# Altium schematic sheet waku-ctl.SchDoc (part 3 of 5)
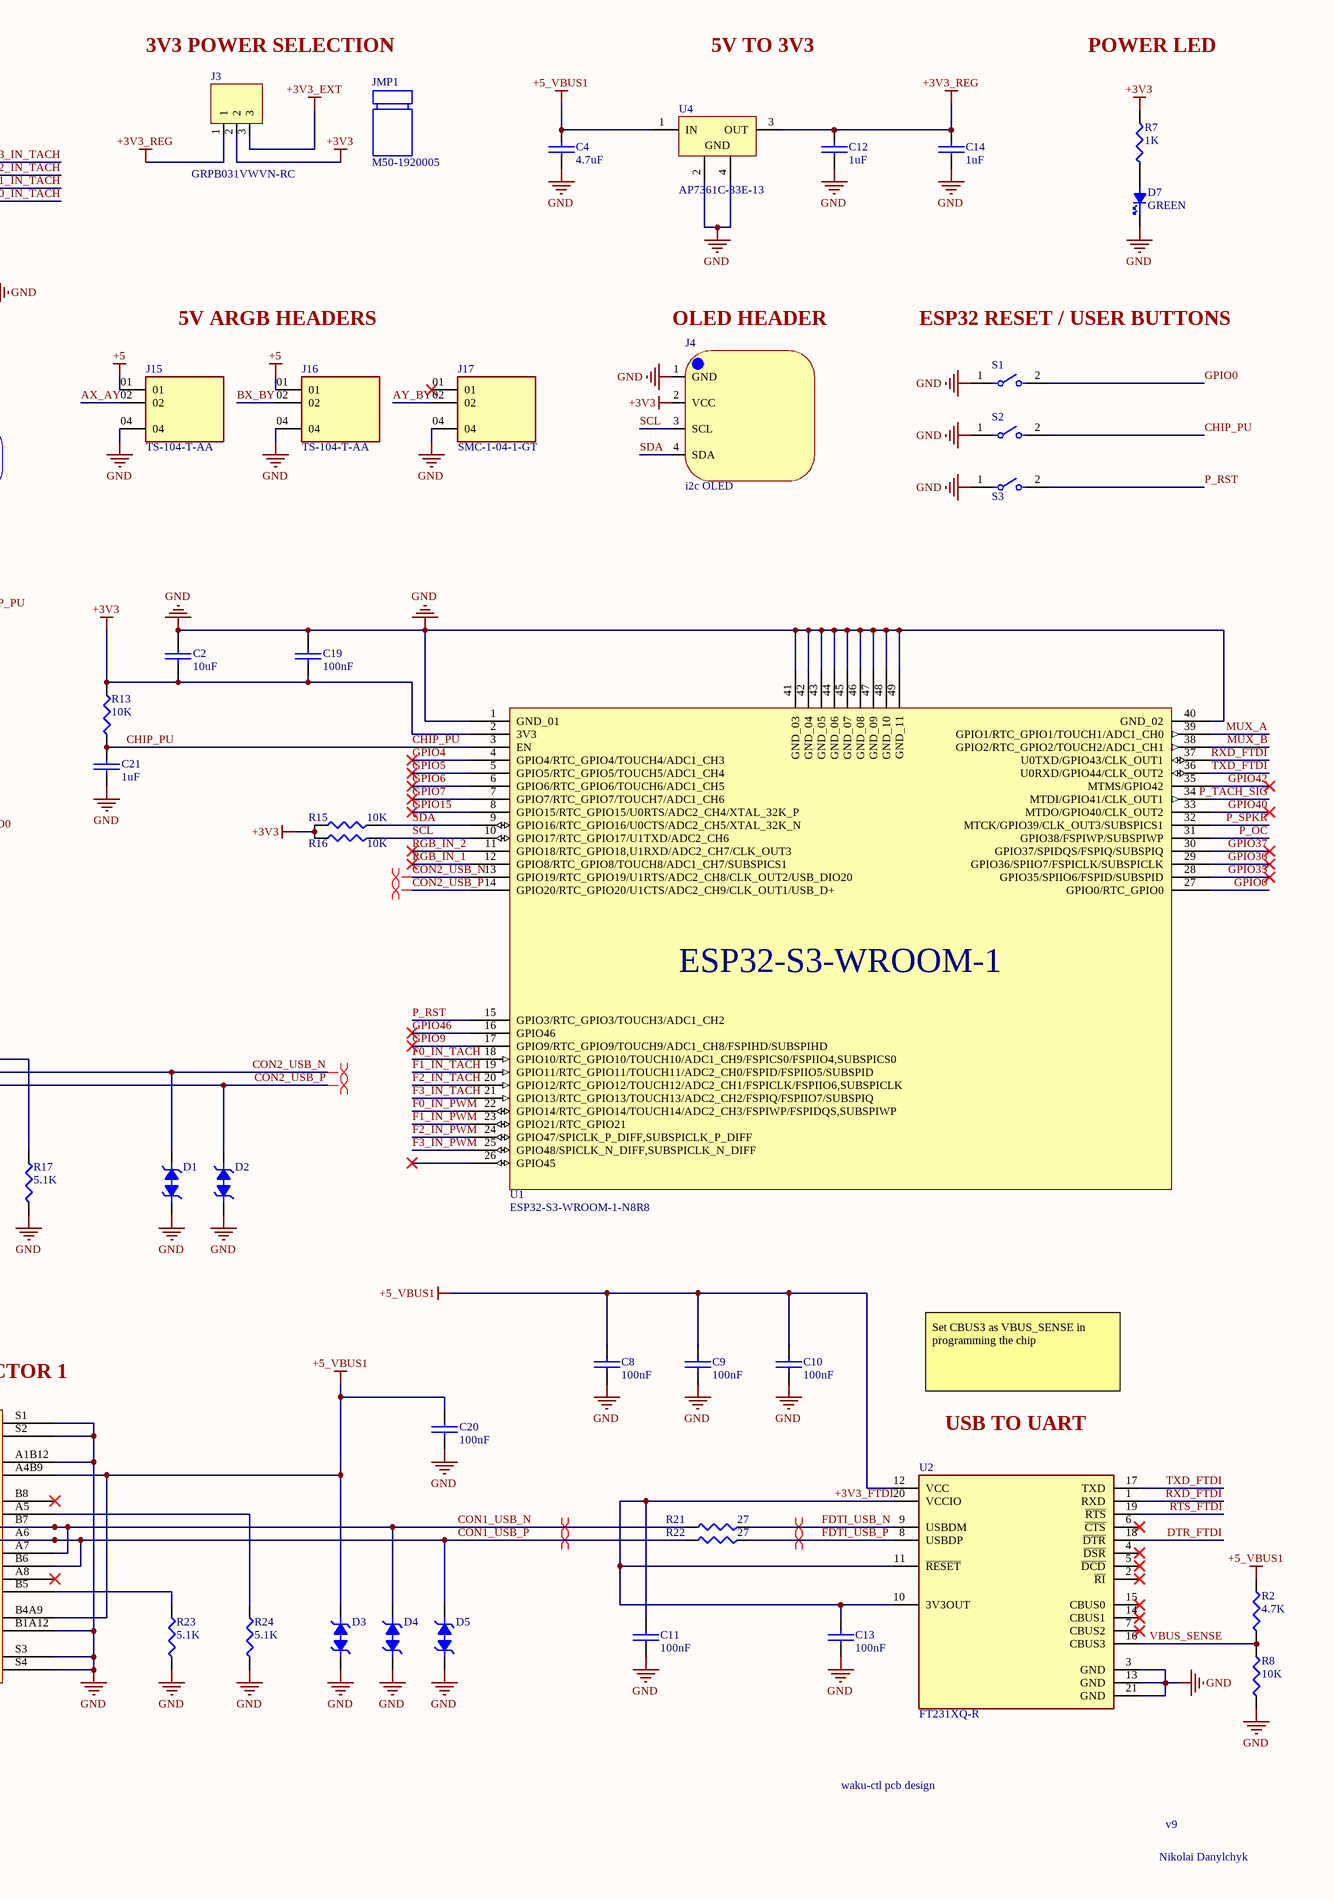
[diagram p3: waku-ctl.SchDoc, right]

## Library data of the parts (continued)
J13 = SSQ-102-02-T-S-RA: CONN RCPT 2POS 0.1 TIN PCB R/A; Manufacturer: Samtec; Manufacturer Lifecycle Status: PRODUCTION; Connector Type: Receptacle, Socket; Contact Resistance: 10mΩ; Current Rating: 6.3A; Lead Length: 2.54mm; Max Current Rating: 7.6A; Max Voltage Rating (AC): 550V; Number of Contacts: 2; Voltage Rating: 655V; Voltage Rating (AC): 465V; Supplier: DigiKey; Supplier Part Number: SAM1195-02-ND; Manufacturer Part Number: SSQ-102-02-T-S-RA; RoHS: Compliant; Category: Headers and Wire Housings; Stock: 1713; Pricing: 1=0.46, 10=0.39, 100=0.46, 500=0.29552, 1000=0.28141, 5000=0.25688 (EUR); Color: Black; Contact Material: Nickel, Tin; Contact Plating: Tin; Depth: 10.03mm; Height: 2.54mm; Housing Color: Black; Lead Free: Lead Free; Length: 5.59mm; Lifecycle Status: Production; Max Operating Temperature: 105°C; Min Operating Temperature: -55°C; Mounting Technology: Through Hole; Number of Positions: 2; Number of Rows: 1; Orientation: Right Angle; Packaging: Bulk; Pitch: 2.54mm; Radiation Hardening: No; Termination: Solder; Voltage Rating (DC): 655V; Width: 8.51mm; ComponentLink1URL: https://datasheet.octopart.com:443/SSQ-102-02-T-S-RA-Samtec-datasheet-150873487.pdf?src-supplier=Upverter; ComponentLink1Description: https://datasheet.octopart.com:443/SSQ-102-02-T-S-RA-Samtec-datasheet-150873487.pdf?src-supplier=Upverter; ComponentLink2URL: https://sigma.octopart.com:443/17020302/technical_drawing/Samtec-SSQ-102-02-T-S-RA.pdf?src-supplier=Upverter; ComponentLink2Description: https://sigma.octopart.com:443/17020302/technical_drawing/Samtec-SSQ-102-02-T-S-RA.pdf?src-supplier=Upverter; ComponentLink3URL: https://datasheet.octopart.com:443/SSQ-102-02-T-S-RA-Samtec-datasheet-97291133.pdf?src-supplier=element14+APAC; ComponentLink3Description: https://datasheet.octopart.com:443/SSQ-102-02-T-S-RA-Samtec-datasheet-97291133.pdf?src-supplier=element14+APAC; ComponentLink4URL: https://sigma.octopart.com:443/97291134/technical_drawing/Samtec-SSQ-102-02-T-S-RA.pdf?src-supplier=Samtec; ComponentLink4Description: https://sigma.octopart.com:443/97291134/technical_drawing/Samtec-SSQ-102-02-T-S-RA.pdf?src-supplier=Samtec; ComponentLink5URL: https://datasheet.octopart.com:443/SSQ-102-02-T-S-RA-Samtec-datasheet-118235309.pdf?src-supplier=Electro+Sonic; ComponentLink5Description: https://datasheet.octopart.com:443/SSQ-102-02-T-S-RA-Samtec-datasheet-118235309.pdf?src-supplier=Electro+Sonic; ComponentLink6URL: https://datasheet.octopart.com:443/SSQ-102-02-T-S-RA-Samtec-datasheet-86818373.pdf?src-supplier=Sager+Electronics; ComponentLink6Description: https://datasheet.octopart.com:443/SSQ-102-02-T-S-RA-Samtec-datasheet-86818373.pdf?src-supplier=Sager+Electronics; ComponentLink7URL: https://datasheet.octopart.com:443/SSQ-102-02-T-S-RA-Samtec-datasheet-133811811.pdf?src-supplier=JRH+Electronics; ComponentLink7Description: https://datasheet.octopart.com:443/SSQ-102-02-T-S-RA-Samtec-datasheet-133811811.pdf?src-supplier=JRH+Electronics; LCSC Part Number: C6824759
J15 J16 = TS-104-T-AA: NEEDLE CONN HEADER VERT 4POS 2.54MM; Manufacturer: Samtec; Manufacturer Lifecycle Status: PRODUCTION; Gender: Male; Max Current Rating: 1A; Number of Contacts: 4; Supplier: DigiKey; Supplier Part Number: SAM16040-ND; Manufacturer Part Number: TS-104-T-AA; RoHS: Compliant; Category: Headers and Wire Housings; Stock: 919; Pricing: 1=0.62, 50=0.4858, 100=0.62, 500=0.3324, 1000=0.31706 (EUR); Contact Material: Brass; Contact Plating: Tin; Lifecycle Status: Production; Max Operating Temperature: 105°C; Min Operating Temperature: -55°C; Mounting Technology: Through Hole; Number of Rows: 1; Orientation: Straight; Pitch: 2.54mm; Radiation Hardening: No; REACH SVHC: No; Termination: Solder; ComponentLink1URL: https://datasheet.octopart.com:443/TS-104-T-AA-Samtec-datasheet-97318998.pdf?src-supplier=Master+Electronics; ComponentLink1Description: https://datasheet.octopart.com:443/TS-104-T-AA-Samtec-datasheet-97318998.pdf?src-supplier=Master+Electronics; ComponentLink2URL: https://datasheet.octopart.com:443/TS-104-T-AA-Samtec-datasheet-150856305.pdf?src-supplier=Electro+Sonic; ComponentLink2Description: https://datasheet.octopart.com:443/TS-104-T-AA-Samtec-datasheet-150856305.pdf?src-supplier=Electro+Sonic; ComponentLink3URL: https://datasheet.octopart.com:443/TS-104-T-AA-Samtec-datasheet-13698575.pdf?src-supplier=Electro+Sonic; ComponentLink3Description: https://datasheet.octopart.com:443/TS-104-T-AA-Samtec-datasheet-13698575.pdf?src-supplier=Electro+Sonic; ComponentLink4URL: https://datasheet.octopart.com:443/TS-104-T-AA-Samtec-datasheet-37173861.pdf?src-supplier=Electro+Sonic; ComponentLink4Description: https://datasheet.octopart.com:443/TS-104-T-AA-Samtec-datasheet-37173861.pdf?src-supplier=Electro+Sonic; ComponentLink5URL: https://datasheet.octopart.com:443/TS-104-T-AA-Samtec-datasheet-41643166.pdf?src-supplier=Farnell; ComponentLink5Description: https://datasheet.octopart.com:443/TS-104-T-AA-Samtec-datasheet-41643166.pdf?src-supplier=Farnell; ComponentLink6URL: https://datasheet.octopart.com:443/TS-104-T-AA-Samtec-datasheet-28904454.pdf?src-supplier=Farnell; ComponentLink6Description: https://datasheet.octopart.com:443/TS-104-T-AA-Samtec-datasheet-28904454.pdf?src-supplier=Farnell; ComponentLink7URL: https://datasheet.octopart.com:443/TS-104-T-AA-Samtec-datasheet-8451641.pdf?src-supplier=Farnell; ComponentLink7Description: https://datasheet.octopart.com:443/TS-104-T-AA-Samtec-datasheet-8451641.pdf?src-supplier=Farnell; ComponentLink8URL: https://datasheet.octopart.com:443/TS-104-T-AA-Samtec-datasheet-179090728.pdf?src-supplier=Sager+Electronics; ComponentLink8Description: https://datasheet.octopart.com:443/TS-104-T-AA-Samtec-datasheet-179090728.pdf?src-supplier=Sager+Electronics; ComponentLink9URL: https://datasheet.octopart.com:443/TS-104-T-AA-Samtec-datasheet-118235246.pdf?src-supplier=Sager+Electronics; ComponentLink9Description: https://datasheet.octopart.com:443/TS-104-T-AA-Samtec-datasheet-118235246.pdf?src-supplier=Sager+Electronics; ComponentLink10URL: https://datasheet.octopart.com:443/TS-104-T-AA-Samtec-datasheet-116533476.pdf?src-supplier=Toby+Electronics; ComponentLink10Description: https://datasheet.octopart.com:443/TS-104-T-AA-Samtec-datasheet-116533476.pdf?src-supplier=Toby+Electronics; ComponentLink11URL: https://datasheet.octopart.com:443/TS-104-T-AA-Samtec-datasheet-116536303.pdf?src-supplier=Toby+Electronics; ComponentLink11Description: https://datasheet.octopart.com:443/TS-104-T-AA-Samtec-datasheet-116536303.pdf?src-supplier=Toby+Electronics; LCSC Part Number: C6886151
J17 = SMC-1-04-1-GT: MACHINE PIN SOCKET 4P 2.54MM PIT; Manufacturer: Adam Tech; Current Rating: 3A; Insulation Resistance: 10GΩ; Supplier: DigiKey; Supplier Part Number: 2057-SMC-1-04-1-GT-ND; Manufacturer Part Number: SMC-1-04-1-GT; RoHS: Compliant; Category: Headers and Wire Housings; Pricing: 1=0.22, 10=0.193, 25=0.22, 50=0.1728, 100=0.1644, 250=0.15408, 500=0.14672, 1000=0.13971, 3000=0.12928 (EUR); Lifecycle Status: Production; Max Operating Temperature: 125°C; Min Operating Temperature: -55°C; Pins: 4; REACH SVHC: Yes; Schedule B: 8536694040, 8536694040|8536694040|8536694040|8536694040|8536694040; Terminal Pitch: 2.54mm; ComponentLink1URL: https://datasheet.octopart.com:443/SMC-1-04-1-GT-Adam-Tech-datasheet-175106907.pdf?src-supplier=IHS; ComponentLink1Description: https://datasheet.octopart.com:443/SMC-1-04-1-GT-Adam-Tech-datasheet-175106907.pdf?src-supplier=IHS; ComponentLink2URL: https://datasheet.octopart.com:443/SMC-1-04-1-GT-Adam-Tech-datasheet-110600998.pdf?src-supplier=RS+(Formerly+Allied+Electronics); ComponentLink2Description: https://datasheet.octopart.com:443/SMC-1-04-1-GT-Adam-Tech-datasheet-110600998.pdf?src-supplier=RS+(Formerly+Allied+Electronics); ComponentLink3URL: http://sigma.octopart.com:80/rohs_statement/Adam-Tech-company-22.pdf?src-supplier=Compliance+Statements; ComponentLink3Description: http://sigma.octopart.com:80/rohs_statement/Adam-Tech-company-22.pdf?src-supplier=Compliance+Statements; ComponentLink4URL: http://sigma.octopart.com:80/reach_statement/Adam-Tech-company-23.pdf?src-supplier=Compliance+Statements; ComponentLink4Description: http://sigma.octopart.com:80/reach_statement/Adam-Tech-company-23.pdf?src-supplier=Compliance+Statements
JMP1 = M50-1920005: CONN SHUNT 1.27MM; Manufacturer: Harwin; Contact Resistance: 20mΩ; Current Rating: 1A; Insulation Resistance: 1GΩ; Number of Positions: 2; Voltage Rating: 500V; Supplier: DigiKey; Supplier Part Number: 952-1727-ND; Manufacturer Part Number: M50-1920005; RoHS: Compliant; Category: Headers and Wire Housings; Stock: 2688; Pricing: 1=0.33, 10=0.284, 25=0.2664, 50=0.2536, 100=0.2414, 250=0.22628, 500=0.21546, 1000=0.20516, 3000=0.18984 (USD); Color: Red; Contact Gender: Female; Contact Plating: Gold; Flammability Rating: UL94 V-0; Height: 2.9972mm; Housing Material: Nylon; Lifecycle Status: Production; Max Operating Temperature: 105°C; Min Operating Temperature: -40°C; Pins: 2; Pitch: 1.27mm; REACH SVHC: Yes; ComponentLink1URL: https://datasheet.octopart.com:443/M50-1920005-Harwin-datasheet-179992058.pdf?src-supplier=IHS; ComponentLink1Description: https://datasheet.octopart.com:443/M50-1920005-Harwin-datasheet-179992058.pdf?src-supplier=IHS; ComponentLink2URL: https://datasheet.octopart.com:443/M50-1920005-Harwin-datasheet-27707384.pdf?src-supplier=Newark; ComponentLink2Description: https://datasheet.octopart.com:443/M50-1920005-Harwin-datasheet-27707384.pdf?src-supplier=Newark; ComponentLink3URL: https://datasheet.octopart.com:443/M50-1920005-Harwin-datasheet-10841850.pdf?src-supplier=element14+APAC; ComponentLink3Description: https://datasheet.octopart.com:443/M50-1920005-Harwin-datasheet-10841850.pdf?src-supplier=element14+APAC; LCSC Part Number: C2758458
OP1 = PS2701A-1-F3-A: OPTOISO 3.75KV 1CH TRANS 4-SOP; Manufacturer: Renesas; Manufacturer Lifecycle Status: ACTIVE; Collector Emitter Breakdown Voltage: 70V; Collector Emitter Saturation Voltage: 300mV; Current Transfer Ratio: 50%; Dark Current: 100nA; Fall Time: 7µs; Forward Current: 50mA; Forward Voltage: 1.4V; Input Current: 5mA; Max Collector Current: 30mA; Max Power Dissipation: 230mW; Number of Channels: 1; Output Voltage: 40V; RAM Size: 16kB; Reverse Breakdown Voltage: 6V; Rise Time: 5µs; Supplier: DigiKey; Supplier Part Number: 559-1154-1-ND; Manufacturer Part Number: PS2701A-1-F3-A; RoHS: Compliant; Category: Optocouplers; Stock: 13270; Pricing: 1=0.84, 10=0.591, 100=0.84, 500=0.36802, 1000=0.34545 (EUR); Case/Package: SOP; China RoHS: Compliant; Collector Emitter Voltage (VCEO): 70V; Contact Plating: Tin Bismuth; Export Control Classification Number (ECCN) Code: EAR99; Part Family: PS2701A-1; Height: 2.3mm; Harmonized Tariff Schedule (HTS) Code: 8541.49.8000; Isolation Voltage: 3.75kV; Lead Free: Lead Free; Lifecycle Status: Production; Max Input Current: 30mA; Max Operating Temperature: 100°C; Max Output Voltage: 70V; Min Operating Temperature: -55°C; MSL: 1; Mounting Technology: Surface Mount; Number of Circuits: 1; Number of Elements: 1; Pins: 4; Power Dissipation: 230mW; Radiation Hardening: No; REACH SVHC: Yes; Reverse Voltage: 6V; ComponentLink1URL: https://datasheet.octopart.com:443/PS2701A-1-F3-A-Renesas-datasheet-157819089.pdf?src-supplier=Newark; ComponentLink1Description: https://datasheet.octopart.com:443/PS2701A-1-F3-A-Renesas-datasheet-157819089.pdf?src-supplier=Newark; ComponentLink2URL: https://datasheet.octopart.com:443/PS2701A-1-F3-A-Renesas-datasheet-179182223.pdf?src-supplier=Integrated+Device+Technology; ComponentLink2Description: https://datasheet.octopart.com:443/PS2701A-1-F3-A-Renesas-datasheet-179182223.pdf?src-supplier=Integrated+Device+Technology; ComponentLink3URL: https://datasheet.octopart.com:443/PS2701A-1-F3-A-Renesas-datasheet-149188193.pdf?src-supplier=Integrated+Device+Technology; ComponentLink3Description: https://datasheet.octopart.com:443/PS2701A-1-F3-A-Renesas-datasheet-149188193.pdf?src-supplier=Integrated+Device+Technology; ComponentLink4URL: https://datasheet.octopart.com:443/PS2701A-1-F3-A-NEC-datasheet-180895236.pdf?src-supplier=IHS; ComponentLink4Description: https://datasheet.octopart.com:443/PS2701A-1-F3-A-NEC-datasheet-180895236.pdf?src-supplier=IHS; ComponentLink5URL: https://datasheet.octopart.com:443/PS2701A-1-F3-A-Renesas-datasheet-141895261.pdf?src-supplier=Renesas; ComponentLink5Description: https://datasheet.octopart.com:443/PS2701A-1-F3-A-Renesas-datasheet-141895261.pdf?src-supplier=Renesas; ComponentLink6URL: https://datasheet.octopart.com:443/PS2701A-1-F3-A-Renesas-datasheet-138175344.pdf?src-supplier=Renesas; ComponentLink6Description: https://datasheet.octopart.com:443/PS2701A-1-F3-A-Renesas-datasheet-138175344.pdf?src-supplier=Renesas; ComponentLink7URL: https://datasheet.octopart.com:443/PS2701A-1-F3-A-Renesas-datasheet-5436770.pdf?src-supplier=element14+APAC; ComponentLink7Description: https://datasheet.octopart.com:443/PS2701A-1-F3-A-Renesas-datasheet-5436770.pdf?src-supplier=element14+APAC; ComponentLink8URL: https://datasheet.octopart.com:443/PS2701A-1-F3-A-Renesas-datasheet-164380605.pdf?src-supplier=SOS+electronic; ComponentLink8Description: https://datasheet.octopart.com:443/PS2701A-1-F3-A-Renesas-datasheet-164380605.pdf?src-supplier=SOS+electronic; ComponentLink9URL: https://datasheet.octopart.com:443/PS2701A-1-F3-A-Renesas-datasheet-134697512.pdf?src-supplier=TME; ComponentLink9Description: https://datasheet.octopart.com:443/PS2701A-1-F3-A-Renesas-datasheet-134697512.pdf?src-supplier=TME; ComponentLink10URL: https://datasheet.octopart.com:443/PS2701A-1-F3-A-Renesas-datasheet-136482170.pdf?src-supplier=Future+Electronics; ComponentLink10Description: https://datasheet.octopart.com:443/PS2701A-1-F3-A-Renesas-datasheet-136482170.pdf?src-supplier=Future+Electronics; ComponentLink11URL: http://sigma.octopart.com:80/conflict_mineral_statement/Renesas-company-44.pdf?src-supplier=Compliance+Statements; ComponentLink11Description: http://sigma.octopart.com:80/conflict_mineral_statement/Renesas-company-44.pdf?src-supplier=Compliance+Statements; ComponentLink12URL: http://sigma.octopart.com:80/reach_statement/Renesas-company-45.pdf?src-supplier=Compliance+Statements; ComponentLink12Description: http://sigma.octopart.com:80/reach_statement/Renesas-company-45.pdf?src-supplier=Compliance+Statements; LCSC Part Number: C5334508
Q1-Q3 = SS8050-G: TRANS NPN 25V 1.5A SOT-23-3; Manufacturer: Comchip; Collector Base Voltage (VCBO): 40V; Collector Emitter Saturation Voltage: 500mV; Emitter Base Voltage (VEBO): 5V; hFE Min: 40; Max Junction Temperature (Tj): 150°C; Max Power Dissipation: 300mW; Number of Elements: 1; Transition Frequency: 100MHz; Supplier: DigiKey; Supplier Part Number: 641-1790-1-ND; Manufacturer Part Number: SS8050-G; RoHS: Compliant; Category: BJTs; Stock: 59487; Pricing: 1=0.2, 10=0.126, 100=0.2, 500=0.05756, 1000=0.05078 (EUR); Case/Package: TO-236-3; Collector Emitter Breakdown Voltage: 25V; Collector Emitter Voltage (VCEO): 25V; Height: 1.15mm; Lifecycle Status: Production; Max Breakdown Voltage: 25V; Max Collector Current: 1.5A; Max Operating Temperature: 150°C; Mounting Technology: Surface Mount; Number of Terminals: 3; Power Dissipation: 300mW; REACH SVHC: Yes; Schedule B: 8541100070|8541100070|8541100070|8541100070|8541100070; ComponentLink1URL: https://datasheet.octopart.com:443/SS8050-G-Comchip-datasheet-180131983.pdf?src-supplier=IHS; ComponentLink1Description: https://datasheet.octopart.com:443/SS8050-G-Comchip-datasheet-180131983.pdf?src-supplier=IHS; ComponentLink2URL: https://datasheet.octopart.com:443/SS8050-G-Comchip-datasheet-155422643.pdf?src-supplier=Upverter; ComponentLink2Description: https://datasheet.octopart.com:443/SS8050-G-Comchip-datasheet-155422643.pdf?src-supplier=Upverter; ComponentLink3URL: https://datasheet.octopart.com:443/SS8050-G-Comchip-datasheet-189767092.pdf?src-supplier=ODG+(Origin+Data+Global); ComponentLink3Description: https://datasheet.octopart.com:443/SS8050-G-Comchip-datasheet-189767092.pdf?src-supplier=ODG+(Origin+Data+Global); LCSC Part Number: C164886
R1 = RC0603FR-07330RL: RES 330 OHM 1% 1/10W 0603; Manufacturer: Yageo Group; Value: 47µF; ESR (Equivalent Series Resistance): 800mΩ; Max Power Dissipation: 100mW; Temperature Coefficient: 100ppm/°C; Voltage Rating: 16V; Voltage Rating (AC): 50V; Working Voltage: 75V; Supplier: DigiKey; Supplier Part Number: 311-330HRCT-ND; Manufacturer Part Number: RC0603FR-07330RL; RoHS: Compliant; Category: Chip SMD Resistors; Stock: 52985; Pricing: 1=0.1, 10=0.022, 25=0.0164, 50=0.013, 100=0.0106, 250=0.00812, 500=0.00676, 1000=0.00569 (USD); Case/Package: 2917; Case Code (Imperial): 2917; Case Code (Metric): 7343; China RoHS: Non-Compliant; Composition: Thick Film; Depth: 800µm; Features: Moisture Resistant; Height: 450µm; Lead Free: Lead Free; Length: 7.3mm; Lifecycle Status: Production; Max Operating Temperature: 155°C; Min Operating Temperature: -55°C; Mounting Technology: Surface Mount; Pins: 2; Number of Terminals: 2; Number of Terminations: 2; Packaging: Tape and Reel; Power Dissipation: 100mW; Power Rating: 100mW; Radiation Hardening: No; REACH SVHC: Yes; Schedule B: 8533210045, 8533210045|8533210045, 8533210045|8533210045|8533210045, 8533210045|8533210045|8533210045|8533210045; Termination: SMD/SMT; Tolerance: 1%; Voltage Rating (DC): 16V; Width: 800µm; ComponentLink1URL: https://datasheet.octopart.com:443/RC0603FR-07330RL-Yageo-datasheet-175887523.pdf?src-supplier=IHS; ComponentLink1Description: https://datasheet.octopart.com:443/RC0603FR-07330RL-Yageo-datasheet-175887523.pdf?src-supplier=IHS; ComponentLink2URL: https://datasheet.octopart.com:443/RC0603FR-07330RL-Yageo-datasheet-62067350.pdf?src-supplier=Newark; ComponentLink2Description: https://datasheet.octopart.com:443/RC0603FR-07330RL-Yageo-datasheet-62067350.pdf?src-supplier=Newark; ComponentLink3URL: https://datasheet.octopart.com:443/RC0603FR-07330RL-Yageo-datasheet-12596169.pdf?src-supplier=Newark; ComponentLink3Description: https://datasheet.octopart.com:443/RC0603FR-07330RL-Yageo-datasheet-12596169.pdf?src-supplier=Newark; ComponentLink4URL: https://datasheet.octopart.com:443/RC0603FR-07330RL-Yageo-datasheet-503470.pdf?src-supplier=Newark; ComponentLink4Description: https://datasheet.octopart.com:443/RC0603FR-07330RL-Yageo-datasheet-503470.pdf?src-supplier=Newark; ComponentLink5URL: https://datasheet.octopart.com:443/RC0603FR-07330RL-Yageo-datasheet-34211833.pdf?src-supplier=Newark; ComponentLink5Description: https://datasheet.octopart.com:443/RC0603FR-07330RL-Yageo-datasheet-34211833.pdf?src-supplier=Newark; ComponentLink6URL: https://datasheet.octopart.com:443/RC0603FR-07330RL-Yageo-datasheet-103092701.pdf?src-supplier=Upverter; ComponentLink6Description: https://datasheet.octopart.com:443/RC0603FR-07330RL-Yageo-datasheet-103092701.pdf?src-supplier=Upverter; ComponentLink7URL: https://datasheet.octopart.com:443/RC0603FR-07330RL-Yageo-datasheet-98239111.pdf?src-supplier=Upverter; ComponentLink7Description: https://datasheet.octopart.com:443/RC0603FR-07330RL-Yageo-datasheet-98239111.pdf?src-supplier=Upverter; ComponentLink8URL: https://datasheet.octopart.com:443/RC0603FR-07330RL-Yageo-datasheet-8328172.pdf?src-supplier=element14+APAC; ComponentLink8Description: https://datasheet.octopart.com:443/RC0603FR-07330RL-Yageo-datasheet-8328172.pdf?src-supplier=element14+APAC; ComponentLink9URL: https://datasheet.octopart.com:443/RC0603FR-07330RL-Yageo-datasheet-15599030.pdf?src-supplier=Future+Electronics; ComponentLink9Description: https://datasheet.octopart.com:443/RC0603FR-07330RL-Yageo-datasheet-15599030.pdf?src-supplier=Future+Electronics; ComponentLink10URL: https://datasheet.octopart.com:443/RC0603FR-07330RL-Yageo-datasheet-164759695.pdf?src-supplier=Future+Electronics; ComponentLink10Description: https://datasheet.octopart.com:443/RC0603FR-07330RL-Yageo-datasheet-164759695.pdf?src-supplier=Future+Electronics; ComponentLink11URL: https://datasheet.octopart.com:443/RC0603FR-07330RL-Yageo-datasheet-137700087.pdf?src-supplier=Future+Electronics; ComponentLink11Description: https://datasheet.octopart.com:443/RC0603FR-07330RL-Yageo-datasheet-137700087.pdf?src-supplier=Future+Electronics; ComponentLink12URL: https://datasheet.octopart.com:443/RC0603FR-07330RL-Yageo-datasheet-27584510.pdf?src-supplier=Future+Electronics; ComponentLink12Description: https://datasheet.octopart.com:443/RC0603FR-07330RL-Yageo-datasheet-27584510.pdf?src-supplier=Future+Electronics; ComponentLink13URL: https://datasheet.octopart.com:443/RC0603FR-07330RL-Yageo-datasheet-8324193.pdf?src-supplier=Future+Electronics; ComponentLink13Description: https://datasheet.octopart.com:443/RC0603FR-07330RL-Yageo-datasheet-8324193.pdf?src-supplier=Future+Electronics; ComponentLink14URL: https://datasheet.octopart.com:443/RC0603FR-07330RL-Yageo-datasheet-79472498.pdf?src-supplier=Megastar; ComponentLink14Description: https://datasheet.octopart.com:443/RC0603FR-07330RL-Yageo-datasheet-79472498.pdf?src-supplier=Megastar; ComponentLink15URL: https://datasheet.octopart.com/RC0603FR-07330RL-Yageo-datasheet-73766026.pdf; ComponentLink15Description: https://datasheet.octopart.com/RC0603FR-07330RL-Yageo-datasheet-73766026.pdf; ComponentLink16URL: https://datasheet.octopart.com:443/RC0603FR-07330RL-Yageo-datasheet-13691069.pdf?src-supplier=Farnell; ComponentLink16Description: https://datasheet.octopart.com:443/RC0603FR-07330RL-Yageo-datasheet-13691069.pdf?src-supplier=Farnell; ComponentLink17URL: https://datasheet.octopart.com:443/RC0603FR-07330RL-Yageo-datasheet-118562.pdf?src-supplier=DigiKey; ComponentLink17Description: https://datasheet.octopart.com:443/RC0603FR-07330RL-Yageo-datasheet-118562.pdf?src-supplier=DigiKey; ComponentLink18URL: http://sigma.octopart.com:80/rohs_statement/Yageo-company-2.pdf?src-supplier=Compliance+Statements; ComponentLink18Description: http://sigma.octopart.com:80/rohs_statement/Yageo-company-2.pdf?src-supplier=Compliance+Statements; ComponentLink19URL: http://sigma.octopart.com:80/conflict_mineral_statement/Yageo-company-3.pdf?src-supplier=Compliance+Statements; ComponentLink19Description: http://sigma.octopart.com:80/conflict_mineral_statement/Yageo-company-3.pdf?src-supplier=Compliance+Statements; LCSC Part Number: C105881
R2 = RC0603FR-074K7L: RES 4.7K OHM 1% 1/10W 0603; Manufacturer: Yageo Group; Power Dissipation: 100mW; Value: 4.7kΩ; Temperature Coefficient: 100ppm/°C; Voltage Rating: 75V; Voltage Rating (DC): 50V; Supplier: DigiKey; Supplier Part Number: 311-4.70KHRDKR-ND; Manufacturer Part Number: RC0603FR-074K7L; RoHS: Compliant; Category: Chip SMD Resistors; Stock: 232694; Pricing: 1=0.1, 10=0.009, 25=0.0088, 50=0.0052 (USD); Case/Package: 0603; Case Code (Imperial): 0603; China RoHS: Non-Compliant; Composition: Thick Film; Depth: 800µm; Height: 450µm; Lead Free: Lead Free; Lead Pitch: 300µm; Length: 1.6mm; Lifecycle Status: Production; Max Operating Temperature: 155°C; Military Standard: Not; Min Operating Temperature: -55°C; Mounting Technology: Surface Mount; Pins: 2; Number of Terminals: 2; Packaging: Tape & Reel; Power Rating: 100mW; REACH SVHC: Yes; Schedule B: 8533210045, 8533210045|8533210045|8533210045|8533210045|8533210045|8533210045|8533210045|8533210045|8533210045|8533210045|8533210045|8533210045|8533210045|8533210045|8533210045|8533210045|8533210045|8533210045|8533210045|8533210045|8533210045|8533210045|8533210045|85; Termination: SMD/SMT; Tolerance: 1%; Width: 800µm; Working Voltage: 75V; ComponentLink1URL: https://datasheet.octopart.com:443/RC0603FR-074K7L-Yageo-datasheet-175887523.pdf?src-supplier=IHS; ComponentLink1Description: https://datasheet.octopart.com:443/RC0603FR-074K7L-Yageo-datasheet-175887523.pdf?src-supplier=IHS; ComponentLink2URL: https://datasheet.octopart.com:443/RC0603FR-074K7L-Yageo-datasheet-103092701.pdf?src-supplier=Upverter; ComponentLink2Description: https://datasheet.octopart.com:443/RC0603FR-074K7L-Yageo-datasheet-103092701.pdf?src-supplier=Upverter; ComponentLink3URL: https://datasheet.octopart.com:443/RC0603FR-074K7L-Yageo-datasheet-8328172.pdf?src-supplier=Farnell; ComponentLink3Description: https://datasheet.octopart.com:443/RC0603FR-074K7L-Yageo-datasheet-8328172.pdf?src-supplier=Farnell; ComponentLink4URL: https://datasheet.octopart.com:443/RC0603FR-074K7L-Yageo-datasheet-13691069.pdf?src-supplier=Farnell; ComponentLink4Description: https://datasheet.octopart.com:443/RC0603FR-074K7L-Yageo-datasheet-13691069.pdf?src-supplier=Farnell; ComponentLink5URL: https://datasheet.octopart.com:443/RC0603FR-074K7L-Yageo-datasheet-175423674.pdf?src-supplier=Newark; ComponentLink5Description: https://datasheet.octopart.com:443/RC0603FR-074K7L-Yageo-datasheet-175423674.pdf?src-supplier=Newark; ComponentLink6URL: https://datasheet.octopart.com:443/RC0603FR-074K7L-Yageo-datasheet-12596169.pdf?src-supplier=Newark; ComponentLink6Description: https://datasheet.octopart.com:443/RC0603FR-074K7L-Yageo-datasheet-12596169.pdf?src-supplier=Newark; ComponentLink7URL: https://datasheet.octopart.com:443/RC0603FR-074K7L-Yageo-datasheet-503470.pdf?src-supplier=Newark; ComponentLink7Description: https://datasheet.octopart.com:443/RC0603FR-074K7L-Yageo-datasheet-503470.pdf?src-supplier=Newark; ComponentLink8URL: https://datasheet.octopart.com:443/RC0603FR-074K7L-Yageo-datasheet-34211833.pdf?src-supplier=element14+APAC; ComponentLink8Description: https://datasheet.octopart.com:443/RC0603FR-074K7L-Yageo-datasheet-34211833.pdf?src-supplier=element14+APAC; ComponentLink9URL: https://datasheet.octopart.com:443/RC0603FR-074K7L-Yageo-datasheet-62067350.pdf?src-supplier=element14+APAC; ComponentLink9Description: https://datasheet.octopart.com:443/RC0603FR-074K7L-Yageo-datasheet-62067350.pdf?src-supplier=element14+APAC; ComponentLink10URL: https://datasheet.octopart.com:443/RC0603FR-074K7L-Yageo-datasheet-17842380.pdf?src-supplier=element14+APAC; ComponentLink10Description: https://datasheet.octopart.com:443/RC0603FR-074K7L-Yageo-datasheet-17842380.pdf?src-supplier=element14+APAC; ComponentLink11URL: https://datasheet.octopart.com:443/RC0603FR-074K7L-Yageo-datasheet-164759695.pdf?src-supplier=Future+Electronics; ComponentLink11Description: https://datasheet.octopart.com:443/RC0603FR-074K7L-Yageo-datasheet-164759695.pdf?src-supplier=Future+Electronics; ComponentLink12URL: https://datasheet.octopart.com:443/RC0603FR-074K7L-Yageo-datasheet-137700087.pdf?src-supplier=Future+Electronics; ComponentLink12Description: https://datasheet.octopart.com:443/RC0603FR-074K7L-Yageo-datasheet-137700087.pdf?src-supplier=Future+Electronics; ComponentLink13URL: https://datasheet.octopart.com:443/RC0603FR074K7L-Yageo-datasheet-27584510.pdf?src-supplier=Future+Electronics; ComponentLink13Description: https://datasheet.octopart.com:443/RC0603FR074K7L-Yageo-datasheet-27584510.pdf?src-supplier=Future+Electronics; ComponentLink14URL: https://datasheet.octopart.com:443/RC0603FR-074K7L-Yageo-datasheet-15599030.pdf?src-supplier=Future+Electronics; ComponentLink14Description: https://datasheet.octopart.com:443/RC0603FR-074K7L-Yageo-datasheet-15599030.pdf?src-supplier=Future+Electronics; ComponentLink15URL: https://datasheet.octopart.com:443/RC0603FR-074K7L-Yageo-datasheet-79472498.pdf?src-supplier=Megastar; ComponentLink15Description: https://datasheet.octopart.com:443/RC0603FR-074K7L-Yageo-datasheet-79472498.pdf?src-supplier=Megastar; ComponentLink16URL: https://datasheet.octopart.com/RC0603FR-074K7L-Yageo-datasheet-73766026.pdf; ComponentLink16Description: https://datasheet.octopart.com/RC0603FR-074K7L-Yageo-datasheet-73766026.pdf; ComponentLink17URL: https://datasheet.octopart.com:443/RC0603FR-074K7L-Yageo-datasheet-118562.pdf?src-supplier=DigiKey; ComponentLink17Description: https://datasheet.octopart.com:443/RC0603FR-074K7L-Yageo-datasheet-118562.pdf?src-supplier=DigiKey; ComponentLink18URL: http://sigma.octopart.com:80/rohs_statement/Yageo-company-2.pdf?src-supplier=Compliance+Statements; ComponentLink18Description: http://sigma.octopart.com:80/rohs_statement/Yageo-company-2.pdf?src-supplier=Compliance+Statements; ComponentLink19URL: http://sigma.octopart.com:80/conflict_mineral_statement/Yageo-company-3.pdf?src-supplier=Compliance+Statements; ComponentLink19Description: http://sigma.octopart.com:80/conflict_mineral_statement/Yageo-company-3.pdf?src-supplier=Compliance+Statements; LCSC Part Number: C99782
R3-R6 R8 R10-R13 R15 R16 R18-R20 = RC0603FR-0710KL: RES 10K OHM 1% 1/10W 0603; Manufacturer: Yageo Group; Power Dissipation: 100mW; Value: 10kΩ; Temperature Coefficient: 100ppm/°C; Voltage Rating: 75V; Voltage Rating (DC): 50V; Supplier: DigiKey; Supplier Part Number: 311-10.0KHRCT-ND; Manufacturer Part Number: RC0603FR-0710KL; RoHS: Compliant; Category: Chip SMD Resistors; Stock: 14146615; Pricing: 1=0.1, 10=0.006, 25=0.0052 (USD); Case/Package: 0603; Case Code (Imperial): 0603; Case Code (Metric): 0603; China RoHS: Non-Compliant; Composition: Thick Film; Depth: 800µm; Height: 450µm; Lead Free: Lead Free; Lead Pitch: 300µm; Length: 1.6mm; Lifecycle Status: Production; Max Operating Temperature: 155°C; Military Standard: Not; Min Operating Temperature: -55°C; Mounting Technology: Surface Mount; Pins: 2; Number of Terminals: 2; Packaging: Tape & Reel; Power Rating: 100mW; REACH SVHC: Yes; Schedule B: 8533210045, 8533210045|8533210045|8533210045|8533210045|8533210045|8533210045|8533210045|8533210045|8533210045|8533210045|8533210045|8533210045|8533210045|8533210045|8533210045|8533210045|8533210045|8533210045|8533210045|8533210045|8533210045|8533210045|8533210045|85; Termination: SMD/SMT; Tolerance: 1%; Weight: 2.012816mg; Width: 800µm; Working Voltage: 75V; ComponentLink1URL: https://datasheet.octopart.com:443/RC0603FR-0710KL-Yageo-datasheet-175887523.pdf?src-supplier=IHS; ComponentLink1Description: https://datasheet.octopart.com:443/RC0603FR-0710KL-Yageo-datasheet-175887523.pdf?src-supplier=IHS; ComponentLink2URL: https://datasheet.octopart.com:443/RC0603FR-0710KL-Yageo-datasheet-103092701.pdf?src-supplier=Upverter; ComponentLink2Description: https://datasheet.octopart.com:443/RC0603FR-0710KL-Yageo-datasheet-103092701.pdf?src-supplier=Upverter; ComponentLink3URL: https://datasheet.octopart.com:443/RC0603FR-0710KL-Yageo-datasheet-98239111.pdf?src-supplier=Upverter; ComponentLink3Description: https://datasheet.octopart.com:443/RC0603FR-0710KL-Yageo-datasheet-98239111.pdf?src-supplier=Upverter; ComponentLink4URL: https://datasheet.octopart.com:443/RC0603FR-0710KL-Yageo-datasheet-141265859.pdf?src-supplier=Upverter; ComponentLink4Description: https://datasheet.octopart.com:443/RC0603FR-0710KL-Yageo-datasheet-141265859.pdf?src-supplier=Upverter; ComponentLink5URL: https://sigma.octopart.com:443/138820526/technical_drawing/Yageo-RC0603FR-0710KL.pdf?src-supplier=Upverter; ComponentLink5Description: https://sigma.octopart.com:443/138820526/technical_drawing/Yageo-RC0603FR-0710KL.pdf?src-supplier=Upverter; ComponentLink6URL: https://datasheet.octopart.com:443/RC0603FR-0710KL-Yageo-datasheet-8328172.pdf?src-supplier=Farnell; ComponentLink6Description: https://datasheet.octopart.com:443/RC0603FR-0710KL-Yageo-datasheet-8328172.pdf?src-supplier=Farnell; ComponentLink7URL: https://datasheet.octopart.com:443/RC0603FR-0710KL-Yageo-datasheet-13691069.pdf?src-supplier=Farnell; ComponentLink7Description: https://datasheet.octopart.com:443/RC0603FR-0710KL-Yageo-datasheet-13691069.pdf?src-supplier=Farnell; ComponentLink8URL: https://datasheet.octopart.com:443/RC0603FR-0710KL-Yageo-datasheet-62067350.pdf?src-supplier=element14+APAC; ComponentLink8Description: https://datasheet.octopart.com:443/RC0603FR-0710KL-Yageo-datasheet-62067350.pdf?src-supplier=element14+APAC; ComponentLink9URL: https://datasheet.octopart.com:443/RC0603FR-0710KL-Yageo-datasheet-17842380.pdf?src-supplier=element14+APAC; ComponentLink9Description: https://datasheet.octopart.com:443/RC0603FR-0710KL-Yageo-datasheet-17842380.pdf?src-supplier=element14+APAC; ComponentLink10URL: https://datasheet.octopart.com:443/RC0603FR-0710KL-Yageo-datasheet-15599030.pdf?src-supplier=Future+Electronics; ComponentLink10Description: https://datasheet.octopart.com:443/RC0603FR-0710KL-Yageo-datasheet-15599030.pdf?src-supplier=Future+Electronics; ComponentLink11URL: https://datasheet.octopart.com:443/RC0603FR-0710KL-Yageo-datasheet-164759695.pdf?src-supplier=Future+Electronics; ComponentLink11Description: https://datasheet.octopart.com:443/RC0603FR-0710KL-Yageo-datasheet-164759695.pdf?src-supplier=Future+Electronics; ComponentLink12URL: https://datasheet.octopart.com:443/RC0603FR-0710KL-Yageo-datasheet-127823281.pdf?src-supplier=Future+Electronics; ComponentLink12Description: https://datasheet.octopart.com:443/RC0603FR-0710KL-Yageo-datasheet-127823281.pdf?src-supplier=Future+Electronics; ComponentLink13URL: https://datasheet.octopart.com:443/RC0603FR-0710KL-Yageo-datasheet-137700087.pdf?src-supplier=Future+Electronics; ComponentLink13Description: https://datasheet.octopart.com:443/RC0603FR-0710KL-Yageo-datasheet-137700087.pdf?src-supplier=Future+Electronics; ComponentLink14URL: https://datasheet.octopart.com:443/RC0603FR-0710KL-Yageo-datasheet-27584510.pdf?src-supplier=Future+Electronics; ComponentLink14Description: https://datasheet.octopart.com:443/RC0603FR-0710KL-Yageo-datasheet-27584510.pdf?src-supplier=Future+Electronics; ComponentLink15URL: https://datasheet.octopart.com:443/RC0603FR-0710KL-Yageo-datasheet-8324193.pdf?src-supplier=Future+Electronics; ComponentLink15Description: https://datasheet.octopart.com:443/RC0603FR-0710KL-Yageo-datasheet-8324193.pdf?src-supplier=Future+Electronics; ComponentLink16URL: https://datasheet.octopart.com:443/RC0603FR-0710KL-Yageo-datasheet-12596169.pdf?src-supplier=Newark; ComponentLink16Description: https://datasheet.octopart.com:443/RC0603FR-0710KL-Yageo-datasheet-12596169.pdf?src-supplier=Newark; ComponentLink17URL: https://datasheet.octopart.com:443/RC0603FR-0710KL-Yageo-datasheet-503470.pdf?src-supplier=Newark; ComponentLink17Description: https://datasheet.octopart.com:443/RC0603FR-0710KL-Yageo-datasheet-503470.pdf?src-supplier=Newark; ComponentLink18URL: https://datasheet.octopart.com:443/RC0603FR-0710KL-Yageo-datasheet-34211833.pdf?src-supplier=Newark; ComponentLink18Description: https://datasheet.octopart.com:443/RC0603FR-0710KL-Yageo-datasheet-34211833.pdf?src-supplier=Newark; ComponentLink19URL: https://datasheet.octopart.com:443/RC0603FR-0710KL-Yageo-datasheet-79472498.pdf?src-supplier=Megastar; ComponentLink19Description: https://datasheet.octopart.com:443/RC0603FR-0710KL-Yageo-datasheet-79472498.pdf?src-supplier=Megastar; ComponentLink20URL: https://datasheet.octopart.com/RC0603FR-0710KL-Yageo-datasheet-73766026.pdf; ComponentLink20Description: https://datasheet.octopart.com/RC0603FR-0710KL-Yageo-datasheet-73766026.pdf; ComponentLink21URL: https://datasheet.octopart.com:443/RC0603FR-0710KL-Yageo-datasheet-118562.pdf?src-supplier=DigiKey; ComponentLink21Description: https://datasheet.octopart.com:443/RC0603FR-0710KL-Yageo-datasheet-118562.pdf?src-supplier=DigiKey; ComponentLink22URL: http://sigma.octopart.com:80/conflict_mineral_statement/Yageo-company-3.pdf?src-supplier=Compliance+Statements; ComponentLink22Description: http://sigma.octopart.com:80/conflict_mineral_statement/Yageo-company-3.pdf?src-supplier=Compliance+Statements; ComponentLink23URL: http://sigma.octopart.com:80/rohs_statement/Yageo-company-2.pdf?src-supplier=Compliance+Statements; ComponentLink23Description: http://sigma.octopart.com:80/rohs_statement/Yageo-company-2.pdf?src-supplier=Compliance+Statements; LCSC Part Number: C98220
R7 R9 = RC0603FR-101KL: RES 1K OHM 1% 1/10W 0603; Manufacturer: Yageo Group; Power Dissipation: 100mW; Value: 1kΩ; Temperature Coefficient: 100ppm/°C; Voltage Rating: 50V; Working Voltage: 75V; Supplier: DigiKey; Supplier Part Number: 13-RC0603FR-101KLCT-ND; Manufacturer Part Number: RC0603FR-101KL; RoHS: Compliant; Category: Chip SMD Resistors; Stock: 83193; Pricing: 1=0.1, 10=0.008, 25=0.006, 50=0.004, 100=0.004 (USD); Case/Package: 0603; Case Code (Imperial): 0603; Case Code (Metric): 1608; China RoHS: Non-Compliant; Composition: Thick Film; Contact Plating: Lead, Tin; Depth: 800µm; Height: 450µm; Length: 1.6mm; Lifecycle Status: Production; Max Operating Temperature: 155°C; Military Standard: Not; Min Operating Temperature: -55°C; Mounting Technology: Surface Mount; Pins: 2; Number of Terminals: 2; Power Rating: 100mW; Radiation Hardening: No; REACH SVHC: Yes; Schedule B: 8533210045, 8533210045|8533210045|8533210045|8533210045|8533210045; Termination: SMD/SMT; Tolerance: 1%; Voltage Rating (DC): 50V; Width: 800µm; ComponentLink1URL: https://datasheet.octopart.com:443/RC0603FR-101KL-Yageo-datasheet-175887523.pdf?src-supplier=IHS; ComponentLink1Description: https://datasheet.octopart.com:443/RC0603FR-101KL-Yageo-datasheet-175887523.pdf?src-supplier=IHS; ComponentLink2URL: https://datasheet.octopart.com:443/RC0603FR-101KL-Yageo-Group-datasheet-190051977.pdf?src-supplier=Newark; ComponentLink2Description: https://datasheet.octopart.com:443/RC0603FR-101KL-Yageo-Group-datasheet-190051977.pdf?src-supplier=Newark; ComponentLink3URL: https://datasheet.octopart.com:443/RC0603FR-101KL-Yageo-Group-datasheet-189192902.pdf?src-supplier=TME; ComponentLink3Description: https://datasheet.octopart.com:443/RC0603FR-101KL-Yageo-Group-datasheet-189192902.pdf?src-supplier=TME; ComponentLink4URL: https://datasheet.octopart.com:443/RC0603FR-101KL-Yageo-Group-datasheet-176638170.pdf?src-supplier=TME; ComponentLink4Description: https://datasheet.octopart.com:443/RC0603FR-101KL-Yageo-Group-datasheet-176638170.pdf?src-supplier=TME; ComponentLink5URL: https://datasheet.octopart.com:443/RC0603FR-101KL-Yageo-datasheet-8328172.pdf?src-supplier=element14+APAC; ComponentLink5Description: https://datasheet.octopart.com:443/RC0603FR-101KL-Yageo-datasheet-8328172.pdf?src-supplier=element14+APAC; ComponentLink6URL: https://datasheet.octopart.com:443/RC0603FR-101KL-Yageo-datasheet-34211833.pdf?src-supplier=element14+APAC; ComponentLink6Description: https://datasheet.octopart.com:443/RC0603FR-101KL-Yageo-datasheet-34211833.pdf?src-supplier=element14+APAC; ComponentLink7URL: https://datasheet.octopart.com:443/RC0603FR-101KL-Yageo-datasheet-164759695.pdf?src-supplier=Future+Electronics; ComponentLink7Description: https://datasheet.octopart.com:443/RC0603FR-101KL-Yageo-datasheet-164759695.pdf?src-supplier=Future+Electronics; ComponentLink8URL: https://datasheet.octopart.com:443/RC0603FR-101KL-Yageo-datasheet-137700087.pdf?src-supplier=Future+Electronics; ComponentLink8Description: https://datasheet.octopart.com:443/RC0603FR-101KL-Yageo-datasheet-137700087.pdf?src-supplier=Future+Electronics; ComponentLink9URL: https://datasheet.octopart.com:443/RC0603FR-101KL-Yageo-datasheet-134544186.pdf?src-supplier=Future+Electronics; ComponentLink9Description: https://datasheet.octopart.com:443/RC0603FR-101KL-Yageo-datasheet-134544186.pdf?src-supplier=Future+Electronics; ComponentLink10URL: https://datasheet.octopart.com/RC0603FR-101KL-Yageo-datasheet-73766026.pdf; ComponentLink10Description: https://datasheet.octopart.com/RC0603FR-101KL-Yageo-datasheet-73766026.pdf; ComponentLink11URL: http://sigma.octopart.com:80/rohs_statement/Yageo-company-2.pdf?src-supplier=Compliance+Statements; ComponentLink11Description: http://sigma.octopart.com:80/rohs_statement/Yageo-company-2.pdf?src-supplier=Compliance+Statements; ComponentLink12URL: http://sigma.octopart.com:80/conflict_mineral_statement/Yageo-company-3.pdf?src-supplier=Compliance+Statements; ComponentLink12Description: http://sigma.octopart.com:80/conflict_mineral_statement/Yageo-company-3.pdf?src-supplier=Compliance+Statements; LCSC Part Number: C1512170
R14 R17 R23 R24 = RC0603FR-075K1L: RES 5.1K OHM 1% 1/10W 0603; Manufacturer: Yageo Group; Max Power Dissipation: 100mW; Value: 5.1kΩ; Temperature Coefficient: 100ppm/°C; Voltage Rating: 75V; Voltage Rating (DC): 50V; Supplier: DigiKey; Supplier Part Number: 311-5.10KHRCT-ND; Manufacturer Part Number: RC0603FR-075K1L; RoHS: Compliant; Category: Chip SMD Resistors; Stock: 779853; Pricing: 1=0.1, 10=0.007, 25=0.0068, 50=0.0062, 100=0.0056 (USD); Case/Package: 0603; Case Code (Imperial): 0603; China RoHS: Non-Compliant; Composition: Thick Film; Depth: 800µm; Features: Moisture Resistant; Height: 450µm; Lead Free: Lead Free; Lifecycle Status: Production; Max Operating Temperature: 155°C; Military Standard: Not; Min Operating Temperature: -55°C; Mounting Technology: Surface Mount; Pins: 2; Number of Terminals: 2; Number of Terminations: 2; Packaging: Tape & Reel; Power Dissipation: 100mW; Power Rating: 100mW; REACH SVHC: Yes; Schedule B: 8533210045, 8533210045|8533210045, 8533210045|8533210045|8533210045, 8533210045|8533210045|8533210045|8533210045; Termination: SMD/SMT; Tolerance: 1%; Width: 800µm; Working Voltage: 75V; ComponentLink1URL: https://datasheet.octopart.com:443/RC0603FR-075K1L-Yageo-datasheet-175887523.pdf?src-supplier=IHS; ComponentLink1Description: https://datasheet.octopart.com:443/RC0603FR-075K1L-Yageo-datasheet-175887523.pdf?src-supplier=IHS; ComponentLink2URL: https://datasheet.octopart.com:443/RC0603FR-075K1L-Yageo-datasheet-103092701.pdf?src-supplier=Upverter; ComponentLink2Description: https://datasheet.octopart.com:443/RC0603FR-075K1L-Yageo-datasheet-103092701.pdf?src-supplier=Upverter; ComponentLink3URL: https://datasheet.octopart.com:443/RC0603FR-075K1L-Yageo-datasheet-8328172.pdf?src-supplier=Farnell; ComponentLink3Description: https://datasheet.octopart.com:443/RC0603FR-075K1L-Yageo-datasheet-8328172.pdf?src-supplier=Farnell; ComponentLink4URL: https://datasheet.octopart.com:443/RC0603FR-075K1L-Yageo-datasheet-62067350.pdf?src-supplier=Farnell; ComponentLink4Description: https://datasheet.octopart.com:443/RC0603FR-075K1L-Yageo-datasheet-62067350.pdf?src-supplier=Farnell; ComponentLink5URL: https://datasheet.octopart.com:443/RC0603FR-075K1L-Yageo-datasheet-34211833.pdf?src-supplier=element14+APAC; ComponentLink5Description: https://datasheet.octopart.com:443/RC0603FR-075K1L-Yageo-datasheet-34211833.pdf?src-supplier=element14+APAC; ComponentLink6URL: https://datasheet.octopart.com:443/RC0603FR-075K1L-Yageo-datasheet-164759695.pdf?src-supplier=Future+Electronics; ComponentLink6Description: https://datasheet.octopart.com:443/RC0603FR-075K1L-Yageo-datasheet-164759695.pdf?src-supplier=Future+Electronics; ComponentLink7URL: https://datasheet.octopart.com:443/RC0603FR-075K1L-Yageo-datasheet-137700087.pdf?src-supplier=Future+Electronics; ComponentLink7Description: https://datasheet.octopart.com:443/RC0603FR-075K1L-Yageo-datasheet-137700087.pdf?src-supplier=Future+Electronics; ComponentLink8URL: https://datasheet.octopart.com:443/RC0603FR-075K1L-Yageo-datasheet-15599030.pdf?src-supplier=Future+Electronics; ComponentLink8Description: https://datasheet.octopart.com:443/RC0603FR-075K1L-Yageo-datasheet-15599030.pdf?src-supplier=Future+Electronics; ComponentLink9URL: https://datasheet.octopart.com:443/RC0603FR-075K1L-Yageo-datasheet-12596169.pdf?src-supplier=Future+Electronics; ComponentLink9Description: https://datasheet.octopart.com:443/RC0603FR-075K1L-Yageo-datasheet-12596169.pdf?src-supplier=Future+Electronics; ComponentLink10URL: https://datasheet.octopart.com:443/RC0603FR-075K1L-Yageo-datasheet-503470.pdf?src-supplier=Future+Electronics; ComponentLink10Description: https://datasheet.octopart.com:443/RC0603FR-075K1L-Yageo-datasheet-503470.pdf?src-supplier=Future+Electronics; ComponentLink11URL: https://datasheet.octopart.com:443/RC0603FR-075K1L-Yageo-datasheet-148775077.pdf?src-supplier=TME; ComponentLink11Description: https://datasheet.octopart.com:443/RC0603FR-075K1L-Yageo-datasheet-148775077.pdf?src-supplier=TME; ComponentLink12URL: https://datasheet.octopart.com:443/RC0603FR-075K1L-Yageo-datasheet-79472498.pdf?src-supplier=Megastar; ComponentLink12Description: https://datasheet.octopart.com:443/RC0603FR-075K1L-Yageo-datasheet-79472498.pdf?src-supplier=Megastar; ComponentLink13URL: https://datasheet.octopart.com/RC0603FR-075K1L-Yageo-datasheet-73766026.pdf; ComponentLink13Description: https://datasheet.octopart.com/RC0603FR-075K1L-Yageo-datasheet-73766026.pdf; ComponentLink14URL: https://datasheet.octopart.com:443/RC0603FR-075K1L-Yageo-datasheet-118562.pdf?src-supplier=DigiKey; ComponentLink14Description: https://datasheet.octopart.com:443/RC0603FR-075K1L-Yageo-datasheet-118562.pdf?src-supplier=DigiKey; ComponentLink15URL: http://sigma.octopart.com:80/rohs_statement/Yageo-company-2.pdf?src-supplier=Compliance+Statements; ComponentLink15Description: http://sigma.octopart.com:80/rohs_statement/Yageo-company-2.pdf?src-supplier=Compliance+Statements; ComponentLink16URL: http://sigma.octopart.com:80/conflict_mineral_statement/Yageo-company-3.pdf?src-supplier=Compliance+Statements; ComponentLink16Description: http://sigma.octopart.com:80/conflict_mineral_statement/Yageo-company-3.pdf?src-supplier=Compliance+Statements; LCSC Part Number: C105580